# EasyEDA Pro project ProProject_TC264裸片板_2024-07-09.epro, board PCB1
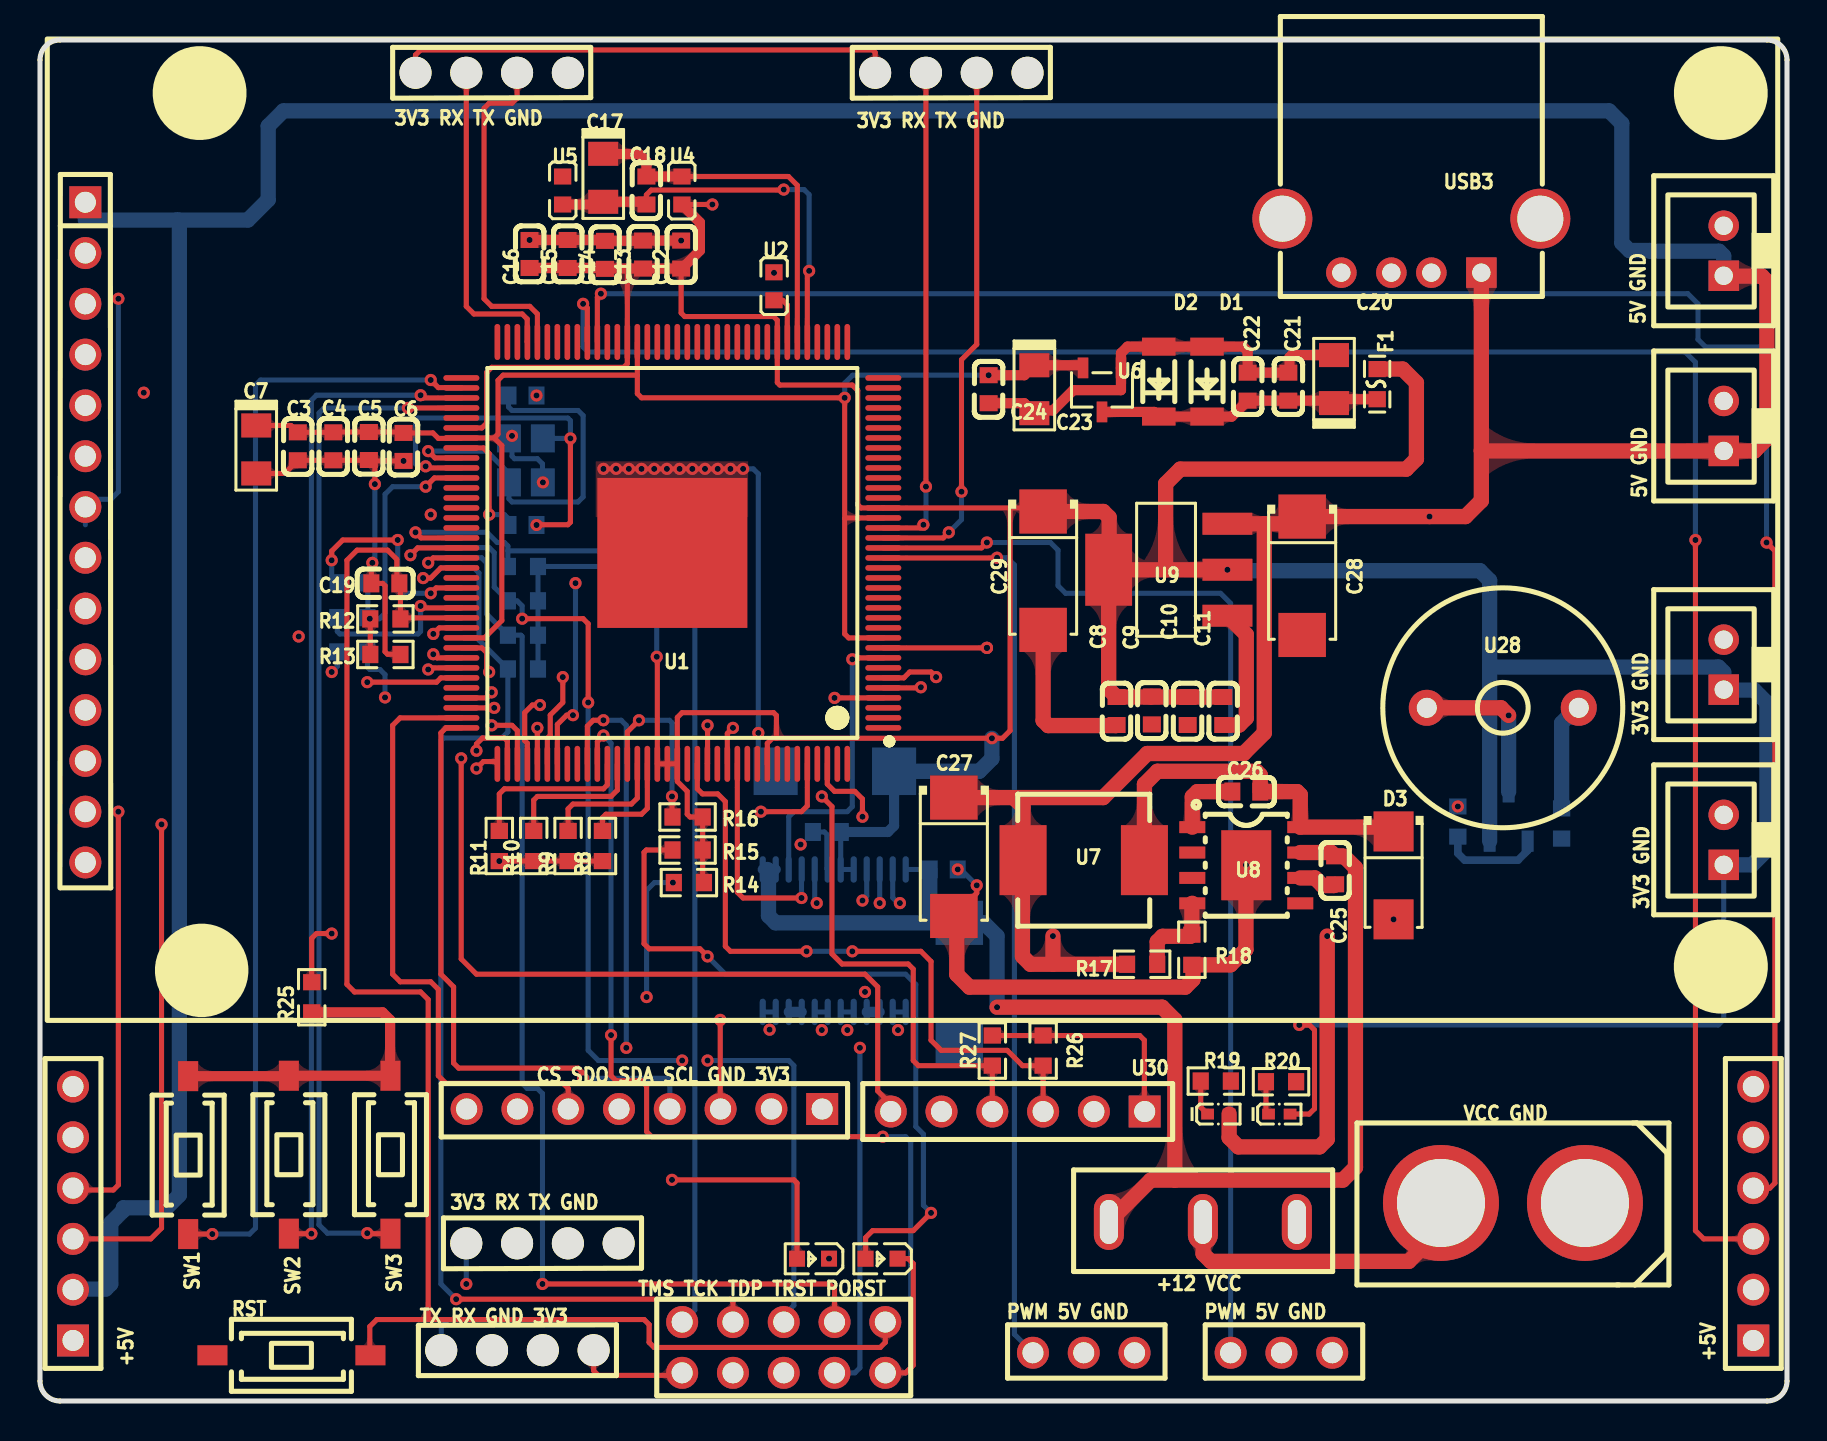
[diagram p1: board, top side]
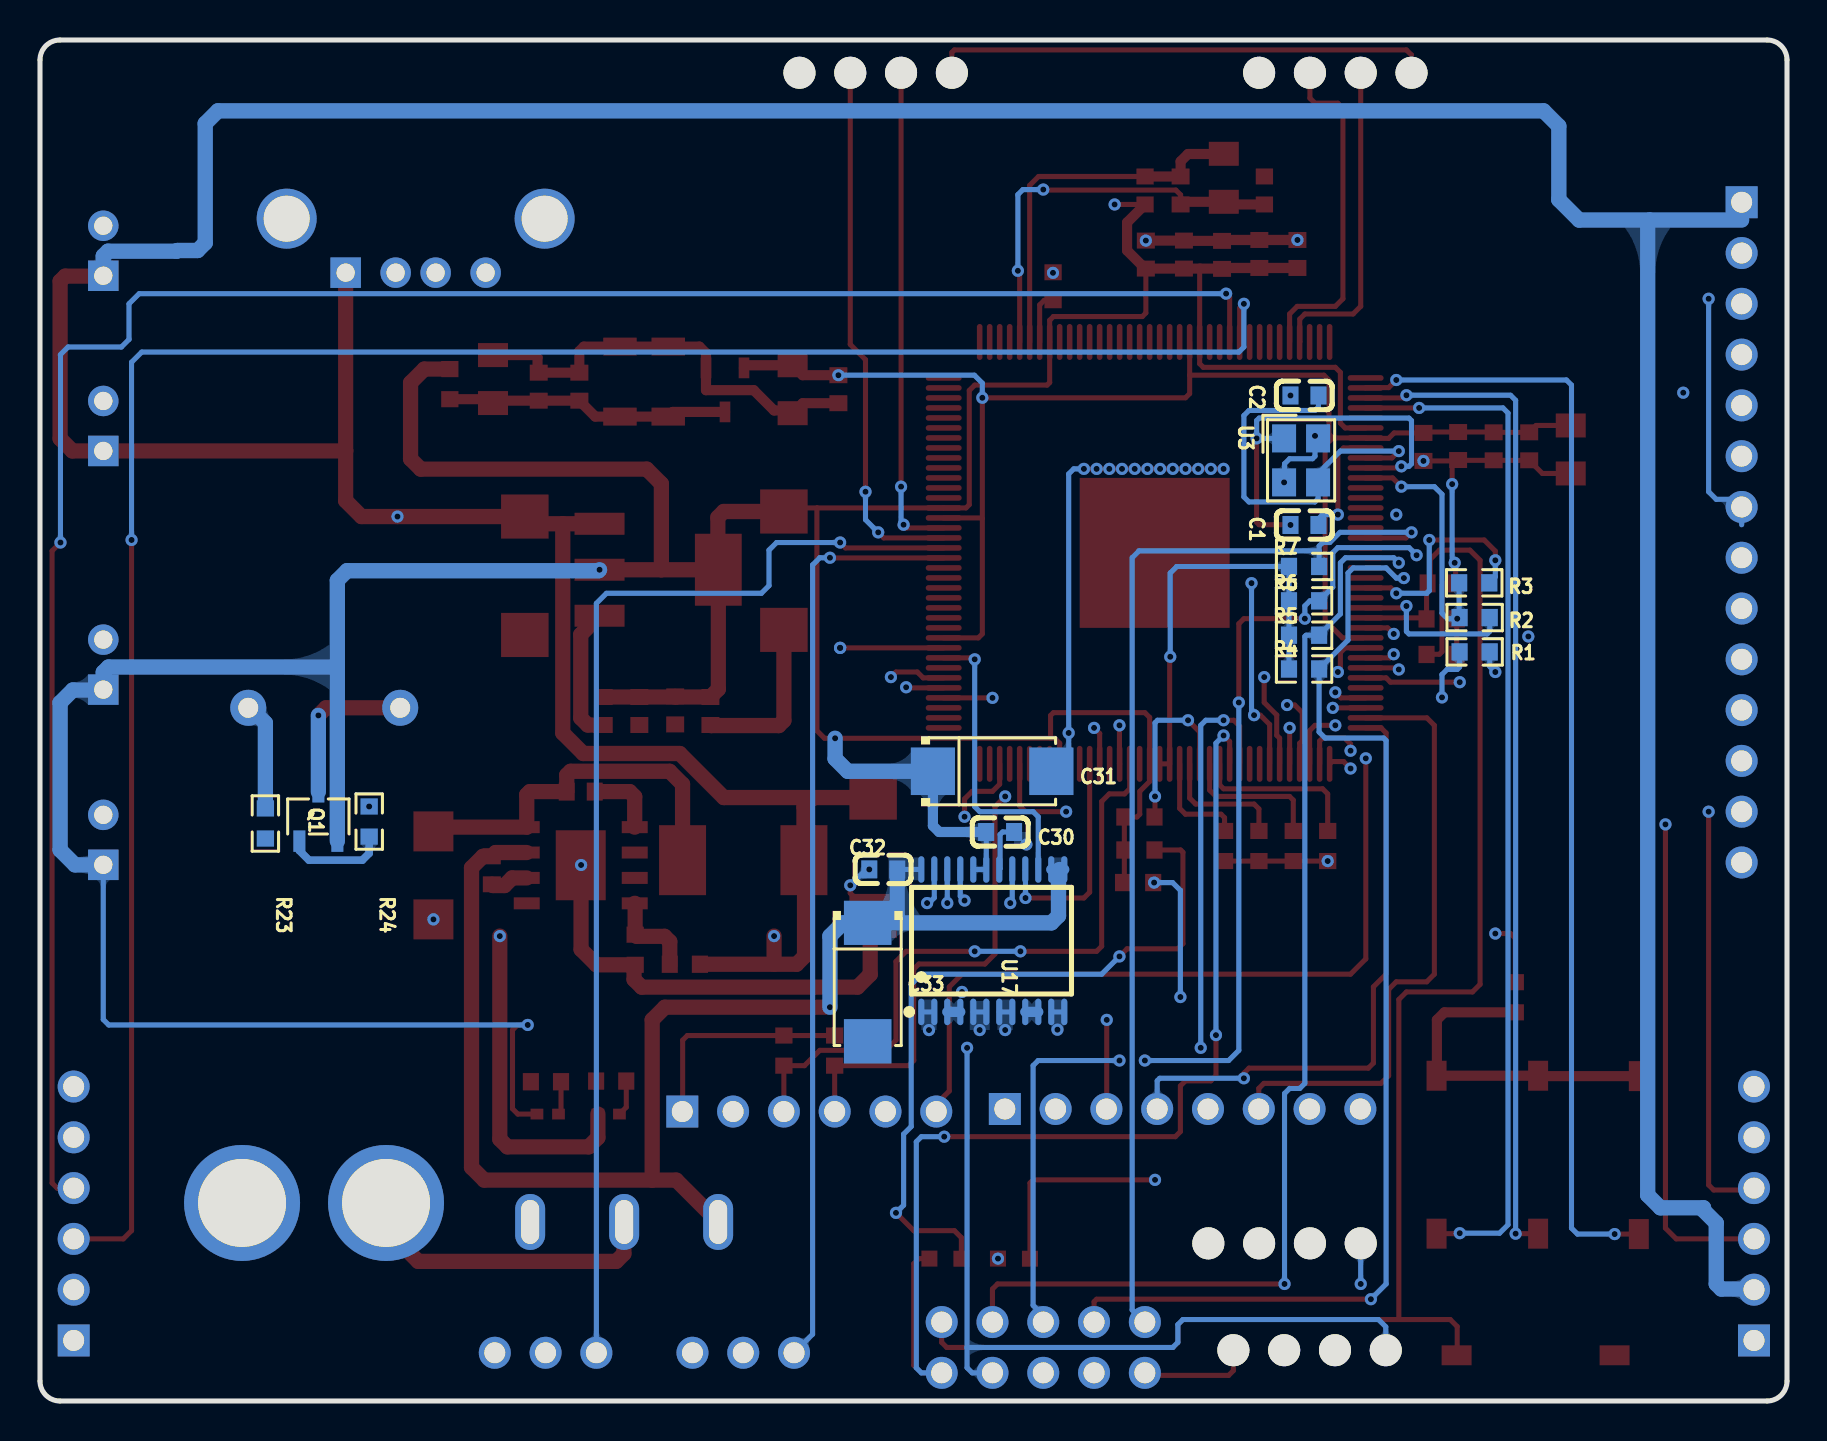
[diagram p2: board, bottom side, seen from below]

Outline 87.37 x 68.07 mm; copper layers: Top Layer, Inner1, Inner2, Bottom Layer. Coordinates in mm from the lower left corner of the outline.
Outline path: 0,67.07 0,1 arc(0.29,0.29) 1,0 86.37,0 arc(87.07,0.29) 87.37,1 87.37,67.07 arc(87.07,67.78) 86.37,68.07 1,68.07 arc(0.29,67.78) 0,67.07
Stack: Top Layer 0.035mm 外层铜厚1oz / Dielectric1 0.2104mm 7628 RC49% 8.6mil / Inner1 0.0152mm 内层铜厚 / Dielectric2 1.065mm 1.1mm H/HOZ 含铜 / Inner2 0.0152mm 内层铜厚 / Dielectric3 0.2104mm 7628 RC49% 8.6mil / Bottom Layer 0.035mm 外层铜厚1oz

## Design rules (mm)
template: JLCPCB Capability(Two Layers Board)
spacing copperThickness1oz (default): track to track 0.102, other pairs 0.152 to 0.3
spacing copperThickness2oz: track to track 0.203, other pairs 0.152 to 0.3
track width copperThickness1oz (default): min 0.127, default 0.254, max 2.54
track width copperThickness2oz: min 0.203, default 0.254, max 2.54
differential pair differentialPair (default): width min 0.127, default 0.254, max 2.54; gap min 0.152, default 0.152
via viaSize (default): diameter min 0.5, default 0.61, max 10; hole min 0.3, default 0.305, max 6.3

## Placement (name value [footprint] x y rotation side)
3V3 GND  -  [CONN-TH_2P-P2.50_BX-XH2.54-2PZZ]  84.2 36.83 90 top
3V3 GND#2  -  [CONN-TH_2P-P2.50_BX-XH2.54-2PZZ]  84.2 28.07 90 top
3V3 RX TX GND  -  [XH2.54-4p]  24.49 7.25 0 top
3V3 RX TX GND#2  -  [XH2.54-4p]  21.95 65.8 0 top
3V3 RX TX GND#3  -  [XH2.54-4p]  44.94 65.8 0 top
5V GND  -  [CONN-TH_2P-P2.50_BX-XH2.54-2PZZ]  84.2 57.53 90 top
5V GND#2  -  [CONN-TH_2P-P2.50_BX-XH2.54-2PZZ]  84.2 48.77 90 top
+5V  -  [XH2.54_6p]  85.94 10.14 90 top
+5V#2  -  [XH2.54_6p]  1.91 10.14 90 top
+12 VCC  -  [钮子开关]  58.17 8.51 270 top
C1  22pF  [C0603]  24.13 43.82 180 bottom
C2  22pF  [C0603]  24.13 50.29 180 bottom
C3  104  [C0603]  12.89 47.75 90 top
C4  104  [C0603]  14.67 47.75 90 top
C5  104  [C0603]  16.45 47.76 90 top
C6  104  [C0603]  18.18 47.72 90 top
C7  106  [CAP-SMD_L3.2-W1.6-FD]  10.81 47.59 270 top
C8  104  [C0603]  53.84 34.51 90 top
C9  104  [C0603]  55.6 34.54 90 top
C10  104  [C0603]  57.39 34.51 90 top
C11  104  [C0603]  59.17 34.51 90 top
C12  104  [C0603]  32.06 57.34 270 top
C13  104  [C0603]  30.16 57.34 270 top
C14  104  [C0603]  28.25 57.32 270 top
C15  104  [C0603]  26.39 57.37 270 top
C16  104  [C0603]  24.48 57.37 270 top
C17  106  [CAP-SMD_L3.2-W1.6-FD]  28.17 61.18 270 top
C18  104  [C0603]  30.33 60.54 90 top
C19  104  [C0603]  17.27 40.89 0 top
C20  107  [CAP-SMD_L3.2-W1.6-FD]  64.71 51.11 90 top
C21  104  [C0603]  62.43 50.73 270 top
C22  104  [C0603]  60.39 50.73 270 top
C23  106  [CAP-SMD_L3.2-W1.6-FD]  49.73 50.61 270 top
C24  104  [C0603]  47.44 50.61 90 top
C25  10uF  [C0603]  64.77 26.54 90 top
C26  0.01uF  [C0603]  60.33 30.48 180 top
C27  220uF  [CAP-SMD_L6.0-W3.2-R-RD]  45.7 27.22 90 top
C28  10uF  [CAP-SMD_L6.0-W3.2-R-RD]  63.12 41.28 90 top
C29  10uF  [CAP-SMD_L6.0-W3.2-R-RD]  50.16 41.53 90 top
C30  0.01uF  [C0603]  39.35 28.46 0 bottom
C31  10uF  [CAP-SMD_L6.0-W3.2-R-RD]  39.75 31.5 0 bottom
C32  0.01uF  [C0603]  45.19 26.59 180 bottom
C33  10uF  [CAP-SMD_L6.0-W3.2-R-RD]  45.97 20.96 90 bottom
CS SDO SDA SCL GND 3V3  -  [MPU6050-8p]  36.45 14.61 180 top
D1  ZMM3V3  [LL-34_L3.5-W1.5-LS3.5-FD]  58.36 50.99 270 top
D2  ZMM3V3  [LL-34_L3.5-W1.5-LS3.5-FD]  55.95 50.99 270 top
D3  B340A  [SMA_L4.3-W2.6-LS5.1-RD]  67.69 26.29 270 top
F1  SMD0603-005-24V  [F0603]  66.87 50.86 270 top
LED2  -  [LED_0603]  38.61 7.11 180 top
LED3  -  [LED_0603]  42.04 7.11 180 top
LED4  -  [LED_0402]  61.98 14.35 0 top
LED5  -  [LED_0402]  58.93 14.35 0 top
PWM 5V GND  -  [X2.54_3p]  50.93 2.41 0 top
PWM 5V GND#2  -  [X2.54_3p]  60.81 2.41 0 top
Q1  S8550  [SOT-23-3_L2.9-W1.6-P1.90-LS2.8-BR]  73.44 29.24 270 bottom
R1  10kΩ  [R0603]  15.62 37.47 0 bottom
R2  10kΩ  [R0603]  15.62 39.18 0 bottom
R3  10kΩ  [R0603]  15.64 40.92 0 bottom
R4  10kΩ  [R0603]  24.15 36.61 0 bottom
R5  10kΩ  [R0603]  24.15 38.3 0 bottom
R6  10kΩ  [R0603]  24.15 40.02 0 bottom
R7  10kΩ  [R0603]  24.15 41.74 0 bottom
R8  10kΩ  [R0603]  28.13 27.76 270 top
R9  10kΩ  [R0603]  26.41 27.76 270 top
R10  10kΩ  [R0603]  24.69 27.76 270 top
R11  10kΩ  [R0603]  22.97 27.76 270 top
R12  10kΩ  [R0603]  17.27 39.12 180 top
R13  1kΩ  [R0603]  17.27 37.34 180 top
R14  10kΩ  [R0603]  32.45 25.93 0 top
R15  10kΩ  [R0603]  32.38 27.56 0 top
R16  10kΩ  [R0603]  32.38 29.21 0 top
R17  10kΩ  [R0603]  55.12 21.84 180 top
R18  3.24kΩ  [R0603]  57.6 22.57 90 top
R19  10kΩ  [R0603]  58.8 16 0 top
R20  4.7kΩ  [R0603]  62.06 15.97 0 top
R23  100Ω  [R0603]  76.09 28.89 270 bottom
R24  100Ω  [R0603]  70.91 28.98 90 bottom
R25  4.7K  [R0603]  13.59 20.19 90 top
R26  2.2kΩ  [R0603]  50.16 17.53 90 top
R27  2.2kΩ  [R0603]  47.62 17.53 90 top
RST  轻触按键3*6*2.5  [SW-SMD_L6.0-W3.6-LS8.0]  12.57 2.29 0 top
SW1  轻触按键3*6*2.5  [SW-SMD_L6.0-W3.6-LS8.0]  7.41 12.3 90 top
SW2  轻触按键3*6*2.5  [SW-SMD_L6.0-W3.6-LS8.0]  12.45 12.32 90 top
SW3  轻触按键3*6*2.5  [SW-SMD_L6.0-W3.6-LS8.0]  17.53 12.32 90 top
TMS TCK TDP TRST PORST  -  [TC264]  37.19 2.55 0 top
TX RX GND 3V3  -  [XH2.54-4p]  24.51 3.18 180 top
U1  TC264D40F200WBCKXUMA1  [LQFP-144_L20.0-W20.0-P0.50-LS22.0-BL-EP]  31.62 42.42 90 top
U2  600Ω±25%100MHz  [L0603]  36.7 55.75 270 top
U3  3225-20MHZ-15PF-10PPM  [CRYSTAL-SMD_4P-L3.2-W2.5-BL]  24.3 47.05 270 bottom
U4  600Ω±25%100MHz  [L0603]  32.1 60.54 90 top
U5  600Ω±25%100MHz  [L0603]  26.13 60.54 270 top
U6  ME6216A13M3G  [SOT-23-3_L3.0-W1.7-P0.95-LS2.9-BR]  53.11 50.57 90 top
U7  15uH  [IND-SMD_L6.6-W6.6]  52.2 27.05 0 top
U8  TPS5430DDAR  [ESOP-8_L4.9-W3.9-P1.27-LS6.0-TL-EP]  60.33 26.8 0 top
U9  AMS1117-3.3  [SOT-223-3_L6.5-W3.4-P2.30-LS7.0-BR]  56.41 41.58 0 top
U17  TB6612FNG,C,8,EL  [SSOP-24_L8.3-W5.6-P0.65-LS7.6-BL]  39.72 23.02 180 bottom
U28  2.6kHz  [BUZ-TH_BD12.0-P7.60-D0.6-FD]  73.15 34.67 0 top
U30  -  [XH2.54_6p]  48.13 14.73 180 top
U32  WJ124-3.81-14P  [电容触摸]  56.37 50.94 270 top
USB3  HXAF90WJDGZB  [USB-A-TH_HXAF90WJDGZB]  68.58 57.79 180 top
VCC GND  XT60  [CONN-TH_XT60]  73.66 9.91 180 top

## Footprints (pads in the part's own frame, mm; a bottom-side part is the same pattern mirrored in y, then rotated)
BUZ-TH_BD12.0-P7.60-D0.6-FD
  round 1.8 hole 1: 1(-3.8,0) 2(3.8,0)
C0603
  rect 0.8x0.9 smd: 1(-0.7,0) 2(0.7,0)
CAP-SMD_L3.2-W1.6-FD
  rect 1.2x1.5 smd: 1(-1.2,0) 2(1.2,0)
CAP-SMD_L6.0-W3.2-R-RD
  rect 2.208x2.376 smd: 1(2.961,0) 2(-2.961,0)
CONN-TH_2P-P2.50_BX-XH2.54-2PZZ
  rect 1.524x1.524 hole 0.914: 1(-1.25,0)
  round 1.524 hole 0.914: 2(1.25,0)
CONN-TH_XT60
  round 5.8 hole 4.4: 1(-3.6,0) 2(3.6,0)
CRYSTAL-SMD_4P-L3.2-W2.5-BL
  rect 1.4x1.2 smd: 1(-1.1,-0.85) 2(1.1,-0.85) 3(1.1,0.85) 4(-1.1,0.85)
ESOP-8_L4.9-W3.9-P1.27-LS6.0-TL-EP
  rect 1.3x0.6 smd: 1(-2.7,1.905) 2(-2.7,0.635) 3(-2.7,-0.635) 4(-2.7,-1.905) 5(2.7,-1.905) 6(2.7,-0.635) 7(2.7,0.635) 8(2.7,1.905)
  rect 2.5x3.5 smd: 9(0,0)
F0603
  rect 0.806x0.864 smd: 1(-0.753,0) 2(0.753,0)
IND-SMD_L6.6-W6.6
  rect 2.35x3.5 smd: 1(-3.035,0) 2(3.035,0)
L0603
  rect 0.8x0.864 smd: 1(-0.7,0) 2(0.7,0)
LED_0402
  rect 0.637x0.541 smd: 1(-0.538,0) 2(0.538,0)
LED_0603
  rect 0.8x0.8 smd: 1(-0.851,-0.01) 2(0.75,-0.005)
LL-34_L3.5-W1.5-LS3.5-FD
  rect 0.9x1.677 smd: 1(-1.75,0)
  rect 0.9x1.676 smd: 2(1.75,0)
LQFP-144_L20.0-W20.0-P0.50-LS22.0-BL-EP
  oval 0.28x1.8 smd: 1(-8.75,-10.55) 2(-8.25,-10.55) 3(-7.75,-10.55) 4(-7.25,-10.55) 5(-6.75,-10.55) 6(-6.25,-10.55) 7(-5.75,-10.55) 8(-5.25,-10.55) 9(-4.75,-10.55) 10(-4.25,-10.55) 11(-3.75,-10.55) 12(-3.25,-10.55) 13(-2.75,-10.55) 14(-2.25,-10.55) 15(-1.75,-10.55) 16(-1.25,-10.55) 17(-0.75,-10.55) 18(-0.25,-10.55) 19(0.25,-10.55) 20(0.75,-10.55) 21(1.25,-10.55) 22(1.75,-10.55) 23(2.25,-10.55) 24(2.75,-10.55) 25(3.25,-10.55) 26(3.75,-10.55) 27(4.25,-10.55) 28(4.75,-10.55) 29(5.25,-10.55) 30(5.75,-10.55) 31(6.25,-10.55) 32(6.75,-10.55) 33(7.25,-10.55) 34(7.75,-10.55) 35(8.25,-10.55) 36(8.75,-10.55) 73(8.75,10.55) 74(8.25,10.55) 75(7.75,10.55) 76(7.25,10.55) 77(6.75,10.55) 78(6.25,10.55) 79(5.75,10.55) 80(5.25,10.55) 81(4.75,10.55) 82(4.25,10.55) 83(3.75,10.55) 84(3.25,10.55) 85(2.75,10.55) 86(2.25,10.55) 87(1.75,10.55) 88(1.25,10.55) 89(0.75,10.55) 90(0.25,10.55) 91(-0.25,10.55) 92(-0.75,10.55) 93(-1.25,10.55) 94(-1.75,10.55) 95(-2.25,10.55) 96(-2.75,10.55) 97(-3.25,10.55) 98(-3.75,10.55) 99(-4.25,10.55) 100(-4.75,10.55) 101(-5.25,10.55) 102(-5.75,10.55) 103(-6.25,10.55) 104(-6.75,10.55) 105(-7.25,10.55) 106(-7.75,10.55) 107(-8.25,10.55) 108(-8.75,10.55)
  oval 1.8x0.28 smd: 37(10.55,-8.75) 38(10.55,-8.25) 39(10.55,-7.75) 40(10.55,-7.25) 41(10.55,-6.75) 42(10.55,-6.25) 43(10.55,-5.75) 44(10.55,-5.25) 45(10.55,-4.75) 46(10.55,-4.25) 47(10.55,-3.75) 48(10.55,-3.25) 49(10.55,-2.75) 50(10.55,-2.25) 51(10.55,-1.75) 52(10.55,-1.25) 53(10.55,-0.75) 54(10.55,-0.25) 55(10.55,0.25) 56(10.55,0.75) 57(10.55,1.25) 58(10.55,1.75) 59(10.55,2.25) 60(10.55,2.75) 61(10.55,3.25) 62(10.55,3.75) 63(10.55,4.25) 64(10.55,4.75) 65(10.55,5.25) 66(10.55,5.75) 67(10.55,6.25) 68(10.55,6.75) 69(10.55,7.25) 70(10.55,7.75) 71(10.55,8.25) 72(10.55,8.75) 109(-10.55,8.75) 110(-10.55,8.25) 111(-10.55,7.75) 112(-10.55,7.25) 113(-10.55,6.75) 114(-10.55,6.25) 115(-10.55,5.75) 116(-10.55,5.25) 117(-10.55,4.75) 118(-10.55,4.25) 119(-10.55,3.75) 120(-10.55,3.25) 121(-10.55,2.75) 122(-10.55,2.25) 123(-10.55,1.75) 124(-10.55,1.25) 125(-10.55,0.75) 126(-10.55,0.25) 127(-10.55,-0.25) 128(-10.55,-0.75) 129(-10.55,-1.25) 130(-10.55,-1.75) 131(-10.55,-2.25) 132(-10.55,-2.75) 133(-10.55,-3.25) 134(-10.55,-3.75) 135(-10.55,-4.25) 136(-10.55,-4.75) 137(-10.55,-5.25) 138(-10.55,-5.75) 139(-10.55,-6.25) 140(-10.55,-6.75) 141(-10.55,-7.25) 142(-10.55,-7.75) 143(-10.55,-8.25) 144(-10.55,-8.75)
  rect 7.5x7.5 smd: 145(0,0)
MPU6050-8p
  rect 1.6x1.6 hole 1.05: 1(-2.667,0)
  round 1.6 hole 1.05: 2(-0.127,0) 3(2.413,0) 4(4.953,0) 5(7.493,0) 6(10.033,0) 7(12.573,0) 8(15.113,0)
R0603
  rect 0.806x0.864 smd: 1(-0.753,0) 2(0.753,0)
SMA_L4.3-W2.6-LS5.1-RD
  rect 2x2 smd: 1(-2.2,0) 2(2.2,0)
SOT-23-3_L2.9-W1.6-P1.90-LS2.8-BR
  rect 1.07x0.6 smd: 1(1.235,-0.95) 2(1.235,0.95) 3(-1.235,0)
SOT-23-3_L3.0-W1.7-P0.95-LS2.9-BR
  rect 1.038x0.532 smd: 1(1.101,-0.95) 2(1.101,0.95) 3(-1.101,0)
SOT-223-3_L6.5-W3.4-P2.30-LS7.0-BR
  rect 2.5x1.1 smd: 1(2.97,-2.3) 2(2.97,0) 3(2.97,2.3)
  rect 2.34x3.6 smd: 4(-2.97,0)
SSOP-24_L8.3-W5.6-P0.65-LS7.6-BL
  oval 0.308x1.324 smd: 1(-3.575,-3.562) 2(-2.925,-3.562) 3(-2.275,-3.562) 4(-1.625,-3.562) 5(-0.975,-3.562) 6(-0.325,-3.562) 7(0.325,-3.562) 8(0.975,-3.562) 9(1.625,-3.562) 10(2.275,-3.562) 11(2.925,-3.562) 12(3.575,-3.562) 13(3.575,3.562) 14(2.925,3.562) 15(2.275,3.562) 16(1.625,3.562) 17(0.975,3.562) 18(0.325,3.562) 19(-0.325,3.562) 20(-0.975,3.562) 21(-1.625,3.562) 22(-2.275,3.562) 23(-2.925,3.562) 24(-3.575,3.562)
SW-SMD_L6.0-W3.6-LS8.0
  rect 1.5x1 smd: 1(-3.95,0) 2(3.95,0)
TC264
  round 1.6 hole 1.05: 1(-5.08,-1.143) 2(-2.54,-1.143) 3(0,-1.143) 4(2.54,-1.143) 5(5.08,-1.143) 6(5.08,1.397) 7(2.54,1.397) 8(0,1.397) 9(-2.54,1.397) 10(-5.08,1.397)
USB-A-TH_HXAF90WJDGZB
  rect 1.524x1.524 hole 0.914: 1(-3.5,1.35)
  round 1.524 hole 0.914: 2(-1,1.35) 3(1,1.35) 4(3.5,1.35)
  round 3 hole 2.3: 5(6.45,-1.35) 6(-6.45,-1.35)
X2.54_3p
  round 1.6 hole 1.05: 1(-1.27,0) 2(1.27,0) 3(3.81,0)
XH2.54-4p
  round 1.6 hole 4.05x1.05: 1(-3.175,0.635) 2(-0.635,0.635) 3(1.905,0.635) 4(4.445,0.635)
XH2.54_6p
  rect 1.6x1.6 hole 1.05: 1(-7.112,0.254)
  round 1.6 hole 1.05: 2(-4.572,0.254) 3(-2.032,0.254) 4(0.508,0.254) 5(3.048,0.254) 6(5.588,0.254)
电容触摸
  rect 1.6x1.6 hole 1.05: 1(-9.017,-54.102)
  round 1.6 hole 1.05: 2(-6.477,-54.102) 3(-3.937,-54.102) 4(-1.397,-54.102) 5(1.143,-54.102) 6(3.683,-54.102) 7(6.223,-54.102) 8(8.763,-54.102) 9(11.303,-54.102) 10(13.843,-54.102) 11(16.383,-54.102) 12(18.923,-54.102) 13(21.463,-54.102) 14(24.003,-54.102)
钮子开关
  oval 2.8x1.5 hole 2.2x0.9: 1(-0.447,-4.713) 2(-0.447,-0.013) 3(-0.447,4.688)

## Nets
1.3V: C3.2 C4.2 C5.2 C6.2 C7.1 C23.1 C24.2 U1.10 U1.22 U1.58 U1.79 U1.99 U6.2
3V3: 3V3 GND.1 3V3 GND#2.1 3V3 RX TX GND.1 3V3 RX TX GND#2.1 3V3 RX TX GND#3.1 C8.2 C9.2 C10.2 C11.2 C12.2 C13.2 C14.2 C15.2 C16.2 C29.1 C30.2 C31.1 CS SDO SDA SCL GND 3V3.1 F1.1 LED4.2 Q1.2 R1.2 R2.2 R3.2 R4.2 R5.2 R6.2 R7.2 R12.2 R13.2 R14.2 R15.2 R16.2 R26.2 R27.2 TMS TCK TDP TRST PORST.1 TX RX GND 3V3.1 U1.23 U1.44 U1.59 U1.78 U1.83 U1.125 U1.126 U1.127 U1.136 U4.1 U9.2 U9.4 U17.19 U17.20 U30.1
+5V: 5V GND.1 5V GND#2.1 +5V.2 +5V#2.2 C27.1 C28.1 LED5.2 PWM 5V GND.2 PWM 5V GND#2.2 R17.2 U7.1 U9.3 U32.1 USB3.1
+12V: +12 VCC.1 C25.2 C32.2 C33.1 U8.7 U17.13 U17.14 U17.24
GND: 3V3 GND.2 3V3 GND#2.2 3V3 RX TX GND.4 3V3 RX TX GND#2.4 3V3 RX TX GND#3.4 5V GND.2 5V GND#2.2 +5V.5 +5V#2.5 C1.2 C2.1 C3.1 C4.1 C5.1 C6.1 C7.2 C8.1 C9.1 C10.1 C11.1 C12.1 C13.1 C14.1 C15.1 C16.1 C19.1 C25.1 C27.2 C28.2 C29.2 C30.1 C31.2 C32.1 C33.2 CS SDO SDA SCL GND 3V3.2 D3.2 PWM 5V GND.3 PWM 5V GND#2.3 R8.2 R9.2 R10.2 R11.2 R13.1 R18.1 R19.2 R20.2 R23.2 R25.2 RST.1 TMS TCK TDP TRST PORST.2 TMS TCK TDP TRST PORST.3 TX RX GND 3V3.2 U1.80 U1.145 U2.1 U3.2 U3.4 U5.1 U8.6 U8.9 U9.1 U17.3 U17.4 U17.9 U17.10 U17.18 U30.2 U32.2 USB3.4 USB3.5 USB3.6 VCC GND.1
VCC: +12 VCC.2 VCC GND.2
VDDA: C17.1 C18.2 U1.42 U4.2
VSSA: C17.2 C18.1 U1.41 U5.2
AIN1: U1.4 U17.21
AIN2: U1.5 U17.22
AN0: U1.57
AN1: U1.56
AN2: U1.55
AN3: U1.54
AN4: U1.53
AN5: U1.52
AN6: U1.51
AN7: U1.50
AN8: U1.49
AN10: U1.48
AN11: U1.47
AN12: U1.46
AN13: U1.45
AN16: U1.40
AN17: U1.39
AN20: U1.38
AN21: U1.37
AN24: U1.36
AN25: U1.35
AN35: U1.34
AN36: U1.33
AN37: U1.32
AN38: U1.31
AN39: U1.30
AN44: U1.29
AN45: U1.28
AN46: U1.27
AN47: U1.26
AN48: U1.25
AN49: U1.24
AO1: +5V.1 U17.1 U17.2
AO2: +5V.6 U17.5 U17.6
BIN1: U1.132 U17.17
BIN2: U1.133 U17.16
BO1: +5V#2.1 U17.11 U17.12
BO2: +5V#2.6 U17.7 U17.8
BUZZER: R24.2 U1.9
CCD_CLK: U1.13
CCD_SI: U1.14
D+: USB3.3
D-: USB3.2
ESR0: R1.1 U1.98
ESR1: R2.1 U1.96
IMU_CS: CS SDO SDA SCL GND 3V3.6 U1.107
IMU_SCL: CS SDO SDA SCL GND 3V3.3 U1.105
IMU_SDA: CS SDO SDA SCL GND 3V3.4 U1.108
IMU_SDO: CS SDO SDA SCL GND 3V3.5 U1.106
KEY1: SW1.1 U1.74
KEY2: SW2.1 U1.75
KEY3: SW3.1 U1.76
L_ENCA: +5V.3 U1.63
L_ENCB: +5V.4 U1.62
LCD_BLK: U1.115 U32.8
LCD_CS: U1.111 U32.3
LCD_DC: U1.109 U32.5
LCD_MOSI: U1.114 U32.6
LCD_RST: U1.110 U32.4
LCD_SCK: U1.112 U32.7
P0.0: U1.11
P0.1: U1.12
P0.4: U1.15
P0.5: U1.16
P0.6: U1.17
P0.7: PWM 5V GND.1 U1.18
P0.8: PWM 5V GND#2.1 U1.19
P0.9: 3V3 RX TX GND#3.3 U1.20
P0.12: 3V3 RX TX GND#3.2 U1.21
P2.0: U1.1
P2.1: U1.2
P2.2: U1.3
P2.5: U1.6 U17.23
P2.6: U1.7
P2.7: U1.8 U17.15
P10.1: +5V#2.4 U1.140
P10.2: U1.141
P10.3: +5V#2.3 U1.142
P10.5: U1.143
P10.6: U1.144
P11.6: U1.134
P11.9: U1.135
P11.10: U1.137
P11.11: U1.138
P11.12: U1.139
P13.0: U1.128
P13.1: R26.1 U1.129 U30.3
P13.2: R27.1 U1.130 U30.4
P13.3: U1.131
P14.0: 3V3 RX TX GND.3 LED2.1 TMS TCK TDP TRST PORST.4 TX RX GND 3V3.4 U1.118
P14.1: 3V3 RX TX GND.2 LED3.1 TMS TCK TDP TRST PORST.5 TX RX GND 3V3.3 U1.119
P14.2: R11.1 U1.120
P14.3: R10.1 U1.121
P14.4: R16.1 U1.122
P14.5: R9.1 U1.123
P14.6: R8.1 U1.124
P15.4: U1.113 U30.5
P15.7: U1.116
P15.8: U1.117
P20.0: U1.93
P20.2: R3.1 U1.94
P20.3: U1.95
P20.6: U1.100 U32.10
P20.7: U1.101 U32.11
P20.8: U1.102 U30.6 U32.12
P20.9: U1.103 U32.13
P20.10: U1.104
P21.2: U1.84
P21.3: U1.85
P21.4: U1.86
P21.5: U1.87
P21.6: U1.88
P22.3: U1.77
P23.1: U1.73
P32.0: U1.70
P32.4: U1.72
P33.4: U1.60
P33.5: U1.61
P33.8: U1.64
P33.9: U1.65
P33.10: U1.66
P33.11: U1.67
P33.12: 3V3 RX TX GND#2.3 U1.68
P33.13: 3V3 RX TX GND#2.2 U1.69
PORST: C19.2 R12.1 RST.2 TMS TCK TDP TRST PORST.6 U1.97
TCK: R4.1 TMS TCK TDP TRST PORST.9 U1.92
TDO: R6.1 TMS TCK TDP TRST PORST.8 U1.90
TMS: R7.1 TMS TCK TDP TRST PORST.10 U1.89
TRST: R5.1 TMS TCK TDP TRST PORST.7 U1.91
VGATE1P: U1.71
$1N4159: U1.43 U2.2
$1N5074: C1.1 U1.82 U3.1
$1N5220: C2.2 U1.81 U3.3
$1N7124: LED2.2 R14.1
$1N7149: LED3.2 R15.1
$1N7661: C20.1 C21.2 C22.2 D1.2 D2.2 F1.2 U6.3
$1N7734: C20.2 C21.1 C22.1 C23.2 C24.1 D1.1 D2.1 U6.1
$1N8172: C26.2 U8.1
$1N8173: C26.1 D3.1 U7.2 U8.8
$1N8175: R17.1 R18.2 U8.4
$1N8904: LED4.1 R20.1
$1N8906: LED5.1 R19.1
$1N14813: Q1.3 U28.1
$1N14815: Q1.1 R24.1
$1N14820: R23.1 U28.2
$1N14998: R25.1 SW1.2 SW2.2 SW3.2

Pads without a net: +12 VCC 3; CS SDO SDA SCL GND 3V3 7 8; U8 2 3 5; U32 9 14

## Via types
v1: diameter 0.61, hole 0.305, Top Layer to Bottom Layer, 145 vias

## Routing (per net, layer and track width the routed paths; a pad name or vN(x,y) marks a point on that pad's centre or on a via; arc(x,y) is an arc through that point)
1.3V: length 75.5
  Top Layer w0.254: 21.2,38.17 22.23,38.17 23.1,39.04 23.1,47.79 22.72,48.17 ; 29.87,51.31 29.87,50.39 30.08,50.18 v1(40.24,50.18) 40.24,44.14 ; 29.87,51.31 23.16,51.31 22.91,51.05 22.91,48.36 22.72,48.17 ; 29.87,51.31 U1.58 ; 40.24,44.14 40.24,38.37 40.44,38.17 U1.10 ; 40.24,44.14 40.27,44.17 U1.22 ; 22.72,48.17 21.2,48.17 ; C7.1 12.55,48.79 C3.2 C4.2 14.68,48.46 C5.2 18.14,48.46 C6.2 19.65,48.42 19.92,48.15 21.05,48.15 U1.79
  Top Layer w0.508: U6.2 52.03,51.81 C23.1 49.23,51.31 v1(47.44,51.31)
  Bottom Layer w0.254: v1(47.44,51.31) 40.64,51.31 40.24,50.91 v1(40.24,50.18)
3V3: length 440.9
  Top Layer w0.254: v1(30.84,37.22) 30.87,37.19 U1.125 U1.126 U1.127 ; 29.36,56.64 29.37,56.62 U1.59 29.37,51.88 29.19,51.7 22.59,51.7 22.33,51.45 22.33,48.91 22.1,48.67 U1.78 ; U1.127 31.87,30.99 32.37,30.49 32.37,29.35 32.51,29.21 R16.2 R15.2 33.14,26 R14.2 ; U1.127 31.87,34.19 32.11,34.43 36.69,34.43 36.83,34.29 36.83,33.15 ; 36.83,33.15 v1(47.6,33.15) 48.13,33.15 48.51,33.53 48.51,44.66 48.5,44.67 ; 36.83,33.15 36.62,33.15 36.37,32.9 U1.136 ; v1(16.49,39.13) 16.52,39.1 ; 16.52,39.1 R12.2 ; 16.52,39.1 R13.2 ; R27.2 R26.2 54.99,18.28 55.23,18.05 55.23,14.5 U30.1 ; 48.5,44.67 49.99,44.67 C29.1 ; 48.5,44.67 U1.23 41.06,44.67 40.89,44.83 40.89,50.54 40.62,50.81 37,50.81 36.87,50.94 U1.44 36.87,54.05 36.69,54.24 32.24,54.24 32.06,54.42 C12.2 ; LED4.2 63.47,14.35 63.74,14.62 63.74,18.55 63.48,18.81 v1(62.97,18.81) ; U1.83 19.72,46.17 v1(19.29,45.73) ; 3V3 RX TX GND#3.1 41.77,67.45 41.64,67.58 19.03,67.58 18.78,67.32 3V3 RX TX GND#2.1 ; TMS TCK TDP TRST PORST.1 31.99,1.28 27.92,1.28 27.69,1.52 TX RX GND 3V3.1 ; U4.1 v1(33.63,59.84)
  Top Layer w0.508: U4.1 33,58.95 33,57.54 32.1,56.64 C12.2 C13.2 28.27,56.64 C14.2 28.21,56.67 C15.2 C16.2
  Top Layer w0.762: U9.4 53.47,41.6 53.47,44.2 53.17,44.49 C29.1 ; U9.4 53.44,35.61 C8.2 55.57,35.21 ; U9.4 56.29,41.58 ; 55.57,35.21 C9.2 ; 55.57,35.21 C10.2 C11.2 ; 56.29,41.58 56.29,45.88 57.02,46.61 68.33,46.61 68.83,47.12 68.83,50.93 68.15,51.61 F1.1 ; 56.29,41.58 v1(59.38,41.58)
  Inner1 w0.254: v1(16.49,39.13) 16.49,39.76 16.24,40.02 13.19,40.02 12.94,39.76 v1(12.94,38.24) ; 3V3 RX TX GND#3.1 41.77,60.21 41.4,59.84 v1(33.63,59.84) ; CS SDO SDA SCL GND 3V3.1 39.12,12.7 39.35,12.46 54.85,12.46 55.23,12.84 55.23,14.46 U30.1 55.25,18.7 55.35,18.81 v1(62.97,18.81) ; 3V3 RX TX GND#2.1 18.78,64.27 19.03,64.02 19.92,64.02 20.43,63.51 20.43,46.49 20.18,46.24 19.79,46.24 v1(19.29,45.73)
  Inner2 w0.254: TX RX GND 3V3.1 27.67,2.56 27.67,4.84 27.41,5.09 21.7,5.09 21.32,5.47 v1(21.32,5.85) ; v1(12.94,38.24) 12.94,35.32 13.06,35.19 v1(17.25,35.19) ; CS SDO SDA SCL GND 3V3.1 39.1,14.59 39.1,12.59 38.84,12.33 36.56,12.33 36.3,12.08 36.3,5.47 35.92,5.09 33.38,5.09 33.26,4.97 33.26,1.54 33.13,1.41 TMS TCK TDP TRST PORST.1
  Bottom Layer w0.254: v1(17.25,35.19) 17.25,36.33 17,36.59 16.49,36.59 16.37,36.71 R1.2 ; R2.2 16.4,39.21 R3.2 ; v1(62.97,18.81) 83.93,18.81 84.2,19.08 3V3 GND#2.1 ; C30.2 40.04,28.45 U17.19 U17.20 ; v1(16.49,39.13) 16.98,39.13 17.25,39.4 17.25,45.35 17.64,45.73 v1(19.29,45.73) ; v1(30.84,37.22) 30.84,41.41 30.52,41.74 R7.2 R6.2 R5.2 R4.2 ; v1(21.32,5.85) 21.32,7.89
  Bottom Layer w0.508: C30.2 42.4,28.46 42.71,28.77 C31.1
  Bottom Layer w0.762: 3V3 GND#2.1 85.62,26.82 86.36,27.56 86.36,34.93 85.72,35.56 84.22,35.56 3V3 GND.1 84.2,36.45 83.94,36.71 72.5,36.71 ; v1(47.6,33.15) 47.6,32.13 46.97,31.5 C31.1 ; 72.5,36.71 72.5,41.04 72.01,41.53 59.43,41.53 v1(59.38,41.58) ; 72.5,36.71 Q1.2
+5V: length 363.5
  Top Layer w0.762: v1(64.37,23.25) 64.37,13.09 63.99,12.71 59.93,12.71 59.47,13.17 LED5.2 ; v1(50.66,23.25) 50.66,21.84 ; 72.08,47.53 USB3.1 ; 72.08,47.53 72.1,47.52 5V GND#2.1 85.75,47.52 86.36,48.13 86.36,56.01 86.11,56.26 84.22,56.26 5V GND.1 ; 72.08,47.53 72.08,45.03 71.29,44.24 v1(69.49,44.24) C28.1 62.76,43.88 61.22,43.88 ; C27.1 48.69,30.18 ; 48.69,30.18 49.16,29.71 U7.1 49.13,27.02 49.13,22.24 49.53,21.84 R17.2 ; 48.69,30.18 53.17,30.18 55.37,32.39 60.2,32.39 61.22,33.41 61.22,43.88 ; 61.22,43.88 U9.3
  Inner1 w0.762: 62.06,1.03 80.25,1.03 80.75,1.54 80.75,5.54 ; 62.06,1.03 52.81,1.03 52.2,1.65 PWM 5V GND.2 ; 62.06,1.03 62.08,1.05 PWM 5V GND#2.2 ; 80.75,5.54 80.78,5.57 +5V.2 ; 80.75,5.54 80.75,43.83 80.35,44.24 v1(69.49,44.24) ; v1(50.66,23.25) v1(64.37,23.25)
  Bottom Layer w0.762: 6.87,59.07 6.97,58.97 6.97,10.3 6.33,9.66 4.17,9.66 4.17,9.54 3.54,8.9 3.54,5.85 3.28,5.6 1.68,5.6 +5V#2.2 ; 6.87,59.07 2.27,59.07 ; 6.87,59.07 10.4,59.07 11.41,60.08 11.41,63.77 12.17,64.53 78.47,64.53 79.1,63.89 79.1,57.92 79.48,57.54 80.5,57.54 80.54,57.51 83.97,57.51 84.2,57.27 5V GND.1
+12V: length 72.3
  Top Layer w0.762: v1(47.86,19.7) 56.12,19.7 56.75,19.06 56.75,11.05 ; 56.75,11.05 55.55,11.05 +12 VCC.1 ; 56.75,11.05 65.15,11.05 65.79,11.68 65.79,26.67 65.21,27.24 C25.2 64.58,27.43 U8.7
  Bottom Layer w0.254: U17.24 44.49,26.59 C32.2
  Bottom Layer w0.508: U17.14 U17.13
  Bottom Layer w0.762: v1(47.86,19.7) 47.86,23.25 47.2,23.92 C33.1 ; 36.38,26.59 36.43,26.54 36.43,24.27 36.78,23.92 C33.1 ; C33.1 45.75,24.14 44.56,24.14 44.5,24.21 C32.2
GND: length 192.3
  Top Layer w0.254: 16.49,47.02 16.75,46.77 v1(16.75,45.86) ; 16.49,47.02 v1(18.18,47.02) ; 16.49,47.02 C5.1 16.43,47.05 C4.1 C3.1 12.23,46.39 C7.2 ; U1.80 22.18,47.67 22.46,47.38 v1(22.46,44.34) ; R8.2 R9.2 R10.2 v1(22.97,27.01) ; v1(28.18,46.62) v1(28.81,46.62) v1(29.45,46.62) v1(30.08,46.62) v1(30.72,46.62) v1(31.35,46.62) v1(31.99,46.62) v1(32.62,46.62) v1(33.26,46.62) v1(33.89,46.62) v1(34.53,46.62) v1(35.16,46.62) ; R13.1 18.01,37.35 17.38,37.35 17.25,37.48 17.25,40.78 17.14,40.89 C19.1 16.57,41.87 v1(16.62,41.92) ; v1(46.85,25.79) 46.85,25.4 C27.2 ; v1(14.59,23.38) 13.83,23.38 13.59,23.14 R25.2
  Top Layer w0.508: v1(24.48,58.07) C15.1 28.21,58.07 C14.1 30.14,58.02 C13.1 v1(32.06,58.04)
  Top Layer w0.762: C8.1 53.81,33.78 50.42,33.78 50.16,34.04 C29.2 ; v1(60.31,26.81) 60.31,22.59 59.54,21.82 R18.1 57.66,21.76 57.66,21.08 57.28,20.7 46.48,20.7 45.85,21.34 45.85,24.11 C27.2 ; C25.1 64.71,25.78 64.13,25.78 63.75,26.16 U8.6 ; C11.1 59.97,33.81 60.33,34.16 60.33,38.33 U9.1
  Inner1 w0.254: v1(28.18,46.62) 25.38,46.62 25.15,46.39 v1(25.15,45.95) ; v1(41.26,20.46) 45.7,20.46 45.9,20.65 v1(45.9,26.59) ; v1(60.31,26.81) 67.17,26.81 67.67,26.3 67.67,24.11 v1(67.69,24.09) ; v1(23.61,48.27) 24.79,48.27 24.83,48.23 v1(24.83,50.29) 24.87,50.34 24.87,50.81 24.48,51.2 v1(24.48,58.07) ; v1(22.97,27.01) 14.91,27.01 14.59,26.68 v1(14.59,23.38) 4.43,23.38 3.92,22.87 3.92,13.6 3.54,13.22 1.68,13.22 +5V#2.5 ; v1(35.92,33.41) 36.05,33.54 37.83,33.54 38.04,33.33 v1(38.04,27.84)
  Bottom Layer w0.254: U17.18 39.35,26.63 39.35,28.33 39.23,28.46 38.72,28.46 ; C1.2 23.43,44.13 23.22,44.34 v1(22.46,44.34) ; v1(35.16,46.62) 35.67,46.62 35.92,46.37 v1(35.92,33.41) 35.92,32.36 C31.2 ; v1(16.75,45.86) 16.75,42.05 v1(16.62,41.92) ; v1(23.6,48.27) 23.6,47.26 23.73,47.13 24.87,47.13 25.13,46.88 25.13,45.97 v1(25.15,45.95) ; v1(45.9,26.59) 46.05,26.59 v1(46.85,25.79)
  Bottom Layer w0.508: U17.4 U17.3 ; U17.10 U17.9
  vias: v1(5.19,50.43) v1(36.71,56.43)
VCC: length 15.6
  Top Layer w0.762: VCC GND.2 70.06,8.59 68.45,6.99 58.55,6.99 58.17,7.37 58.17,8.94 +12 VCC.2
VDDA: length 18.6
  Top Layer w0.254: U1.42 37.87,60.8 37.43,61.24 U4.2
  Top Layer w0.508: U4.2 C18.2 30.33,62 29.95,62.37 28.18,62.37 C17.1
VSSA: length 20.5
  Top Layer w0.254: C18.1 30.33,60.33 30.56,60.57 37.17,60.57 v1(37.19,60.59) ; v1(38.46,56.53) 38.37,56.44 U1.41
  Top Layer w0.508: C18.1 30.19,59.98 C17.2 28.03,59.84 U5.2
  Bottom Layer w0.254: v1(37.19,60.59) 38.21,60.59 38.46,60.34 v1(38.46,56.53)
AIN1: length 15.4
  Top Layer w0.254: U1.4 v1(39.73,35.17)
  Inner1 w0.254: v1(41.13,25.03) 40.11,25.03 39.73,25.41 v1(39.73,35.17)
  Bottom Layer w0.254: U17.21 41.34,25.24 v1(41.13,25.03)
AIN2: length 16.4
  Top Layer w0.254: v1(44.05,35.7) 44.02,35.67 U1.5
  Inner1 w0.254: v1(41.99,24.9) 41.99,35.57 42.12,35.7 v1(44.05,35.7)
  Bottom Layer w0.254: U17.22 v1(41.99,24.9)
AO1: length 57.7
  Inner2 w0.508: v1(42.91,18.55) 42.91,16.27 43.8,15.38 43.8,4.33 44.31,3.82 83.29,3.82 84.09,3.03 +5V.1
  Bottom Layer w0.254: U17.2 U17.1
AO2: length 53.7
  Inner2 w0.508: +5V.6 85.71,15.75 85.71,20.84 85.33,21.22 40.75,21.22 40.37,20.85 v1(40.37,18.55)
  Bottom Layer w0.254: U17.6 U17.5
BIN1: length 17.2
  Top Layer w0.254: U1.132 34.37,33.39 v1(34.65,33.67)
  Inner1 w0.254: v1(34.65,33.67) 34.65,24.65 34.91,24.4 38.34,24.4 v1(38.84,24.9)
  Bottom Layer w0.254: U17.17 38.74,25.01 v1(38.84,24.9)
BIN2: length 11.2
  Top Layer w0.254: U1.133 34.87,25.45 35.16,25.16 v1(38.08,25.16)
  Bottom Layer w0.254: U17.16 38.08,26.57 v1(38.08,25.16)
BO1: length 49.4
  Inner2 w0.508: v1(36.49,18.57) 35.29,17.38 35.29,7.12 34.78,6.62 4.43,6.62 3.79,5.98 3.79,3.44 3.38,3.03 +5V#2.1
  Bottom Layer w0.254: U17.12 U17.11
BO2: length 46
  Inner2 w0.508: +5V#2.6 1.63,15.75 1.63,20.97 1.89,21.22 38.84,21.22 39.1,20.97 v1(39.1,18.55)
  Bottom Layer w0.254: U17.8 U17.7
BUZZER: length 36
  Top Layer w0.254: U1.9 v1(47.35,37.67)
  Inner1 w0.254: v1(70.91,29.74) 70.78,29.86 66.15,29.86 65.77,30.24 65.77,36.97 65.07,37.67 v1(47.35,37.67)
ESR0: length 9
  Top Layer w0.254: U1.98 19.97,38.67 v1(19.67,38.37)
  Inner2 w0.254: v1(19.67,38.37) 19.29,37.99 19.16,37.99 18.78,37.6 18.78,36.84 18.52,36.59 14.71,36.59 v1(14.59,36.46)
  Bottom Layer w0.254: v1(14.59,36.46) 14.87,36.74 R1.1
ESR1: length 7.8
  Top Layer w0.254: v1(19.03,39.76) 19.13,39.67 U1.96
  Bottom Layer w0.254: 19.03,39.51 19.03,38.49 18.91,38.37 14.99,38.37 14.87,38.49 14.87,38.93
IMU_CS: length 30.7
  Top Layer w0.254: 26.42,14.61 26.42,15.63 26.16,15.89 20.3,15.89 19.92,16.27 19.92,20.59 19.54,20.97 18.02,20.97 17.64,21.35 17.64,33.79 18.01,34.17 U1.107
IMU_SCL: length 33.9
  Top Layer w0.254: v1(34.02,19.06) 34.02,14.62 CS SDO SDA SCL GND 3V3.3 ; v1(22.59,35.45) 22.31,35.17 U1.105
  Inner1 w0.254: v1(34.02,19.06) 34.02,35.32 33.76,35.57 22.72,35.57 v1(22.59,35.45)
IMU_SDA: length 30.6
  Top Layer w0.254: U1.108 20.3,33.67 20.05,33.41 20.05,21.35 20.68,20.71 20.68,16.9 20.94,16.65 26.91,16.65 27.16,16.4 v1(27.16,16.14)
  Bottom Layer w0.254: v1(27.16,16.14) 31.37,16.14 31.5,16.01 CS SDO SDA SCL GND 3V3.4
IMU_SDO: length 27.3
  Top Layer w0.254: U1.106 v1(22.72,34.67)
  Inner1 w0.254: CS SDO SDA SCL GND 3V3.5 28.94,14.62 28.94,16.4 28.56,16.78 24.37,16.78 24.11,17.03 24.11,34.3 23.75,34.67 v1(22.72,34.67)
KEY1: length 56.2
  Top Layer w0.254: U1.74 21.06,50.69 19.92,50.69 v1(19.54,51.07) ; SW1.1 v1(8.62,8.35)
  Bottom Layer w0.254: v1(19.54,51.07) 11.03,51.07 10.78,50.81 10.78,8.65 10.48,8.35 v1(8.62,8.35)
KEY2: length 50.5
  Top Layer w0.254: U1.75 19.17,50.17 v1(19.03,50.3) ; SW2.1 v1(13.57,8.37)
  Bottom Layer w0.254: v1(13.57,8.37) 13.57,50.05 13.83,50.3 v1(19.03,50.3)
KEY3: length 51.6
  Top Layer w0.254: v1(16.37,8.39) 16.39,8.37 SW3.1 ; 18.4,49.67 U1.76
  Bottom Layer w0.254: v1(18.4,49.67) 14.21,49.67 13.95,49.42 13.95,8.81 14.37,8.39 v1(16.37,8.39)
L_ENCA: length 106.6
  Top Layer w0.254: +5V.3 83.2,8.11 82.79,8.52 v1(82.79,43.07) ; v1(27.16,54.88) 27.37,54.66 U1.63
  Bottom Layer w0.254: v1(82.79,43.07) 82.79,51.96 82.28,52.46 27.41,52.46 27.16,52.72 v1(27.16,54.88)
L_ENCB: length 105.9
  Top Layer w0.254: +5V.4 86.51,10.65 86.76,10.9 86.76,42.52 v1(86.34,42.94) ; U1.62 27.87,55.21 v1(28.05,55.38)
  Bottom Layer w0.254: v1(86.34,42.94) 86.34,52.34 85.96,52.72 83.29,52.72 82.91,53.1 82.91,54.88 82.41,55.38 v1(28.05,55.38)
LCD_BLK: length 40.5
  Top Layer w0.254: v1(26.65,34.3) 26.34,34.3 25.87,33.84 U1.115
  Inner1 w0.254: v1(26.78,40.91) 26.78,44.72 26.4,45.1 5.06,45.1 4.68,44.72 4.68,42.68 4.17,42.18 U32.8
  Bottom Layer w0.254: v1(26.78,40.91) 26.78,34.43 v1(26.65,34.3)
LCD_CS: length 43.1
  Top Layer w0.254: v1(22.59,33.79) 23.6,33.79 23.87,33.53 U1.111
  Inner2 w0.254: v1(22.59,33.79) 21.95,33.79 21.83,33.92 21.83,53.35 21.19,53.99 2.27,53.99
LCD_DC: length 38.9
  Top Layer w0.254: U1.109 22.76,31.98 22.18,31.98 v1(21.83,31.64)
  Inner2 w0.254: 2.27,48.91 2.4,49.03 20.05,49.03 20.3,48.78 20.3,31.51 20.81,31 21.57,31 21.83,31.25 v1(21.83,31.64)
LCD_MOSI: length 37.1
  Top Layer w0.254: U1.114 25.37,33.15 25.52,33.29 25.52,34.31 26.14,34.94 v1(26.14,36.21)
  Inner1 w0.254: v1(26.14,36.21) 26.14,39.51 25.26,40.4 24.11,40.4 23.73,40.78 23.73,43.45 23.48,43.7 20.18,43.7 v1(19.54,44.34)
  Inner2 w0.254: 2.27,46.37 15.73,46.37 16.11,45.99 16.11,44.59 16.37,44.34 v1(19.54,44.34)
LCD_RST: length 41.9
  Top Layer w0.254: U1.110 23.37,33.01 23.22,33.16 22.13,33.16 21.83,32.86 v1(21.83,32.52)
  Inner2 w0.254: 2.27,51.45 2.78,51.96 20.94,51.96 21.32,51.57 21.32,33.03 v1(21.83,32.52)
LCD_SCK: length 58.3
  Top Layer w0.254: v1(25,34.81) 24.62,34.81 24.24,34.43 24.24,33.03 24.37,32.9 U1.112
  Inner2 w0.254: v1(3.92,55.13) 25.13,55.13 25.89,54.37 25.89,37.99 25,37.1 v1(25,34.81)
  Bottom Layer w0.254: v1(3.92,55.13) 3.92,45.48 3.54,45.1 2.65,45.1 U32.7 2.27,43.83
P0.7: length 46.5
  Top Layer w0.254: v1(47.86,42.18) 47.85,42.17 U1.18
  Bottom Layer w0.254: v1(47.86,42.18) 48.37,42.18 48.73,41.82 48.73,3.34 PWM 5V GND.1
P0.8: length 57.3
  Top Layer w0.254: v1(47.35,42.94) 47.08,42.67 U1.19
  Bottom Layer w0.254: PWM 5V GND#2.1 59.54,39.89 59.04,40.4 51.29,40.4 50.91,40.78 50.91,42.56 50.53,42.94 v1(47.35,42.94)
P0.9: length 27
  Top Layer w0.254: v1(46.08,45.48) 46.08,52.08 46.85,52.84 3V3 RX TX GND#3.3 ; v1(45.45,43.45) 45.17,43.17 U1.20
  Bottom Layer w0.254: v1(45.45,43.45) 46.08,44.08 v1(46.08,45.48)
P0.12: length 24.7
  Top Layer w0.254: v1(44.18,43.83) 44.02,43.67 U1.21 ; 3V3 RX TX GND#3.2 v1(44.31,45.73)
  Bottom Layer w0.254: v1(44.18,43.83) 44.31,43.95 v1(44.31,45.73)
P2.5: length 17.4
  Top Layer w0.254: U1.6 43.2,36.17 43.49,36.46 44.56,36.46 v1(44.81,36.21)
  Inner1 w0.254: v1(43,24.9) 43,34.4 43.29,34.68 44.43,34.68 44.81,35.06 v1(44.81,36.21)
  Bottom Layer w0.254: U17.23 42.64,25.17 42.91,24.9
P2.7: length 15
  Top Layer w0.254: U1.8 40.69,37.17 v1(40.62,37.1)
  Bottom Layer w0.254: U17.15 37.44,29.22 37.7,29.48 40.37,29.48 40.62,29.73 v1(40.62,37.1)
P10.1: length 57.8
  Top Layer w0.254: U1.140 38.37,29.77 38.08,29.48 v1(36.05,29.48) ; +5V#2.4 1.75,10.55 3.67,10.55 3.92,10.81 v1(3.92,29.48)
  Inner2 w0.254: v1(36.05,29.48) v1(3.92,29.48)
P10.3: length 64
  Top Layer w0.254: v1(6.08,28.84) 6.08,8.65 5.54,8.11 +5V#2.3 ; v1(41.13,29.22) 41.13,30.11 40.75,30.49 39.73,30.49 39.37,30.85 U1.142
  Inner2 w0.254: v1(41.13,29.22) 40.75,28.84 v1(6.08,28.84)
P13.1: length 33.1
  Top Layer w0.254: U30.3 R26.1 49.13,16.77 48.37,17.54 45.07,17.54 44.56,18.05 44.56,21.98 44.05,22.49 v1(40.62,22.49) ; v1(38.34,22.49) 34.53,22.49 34.27,22.75 34.27,29.98 33.89,30.37 33.13,30.37 32.87,30.62 U1.129
  Bottom Layer w0.254: v1(38.34,22.49) v1(40.62,22.49)
P13.2: length 34.4
  Top Layer w0.254: v1(33.38,33.79) 33.38,31.88 U1.130 ; U30.4 R27.1 43.93,16.77 43.67,17.03 43.67,21.6 43.42,21.86 40.11,21.86 39.61,22.36 39.61,29.73 v1(39.1,30.24)
  Inner2 w0.254: v1(39.1,30.24) 33.64,30.24 33.38,30.49 v1(33.38,33.79)
P14.0: length 94.5
  Top Layer w0.254: v1(28.18,34.05) 27.67,34.05 27.37,33.75 U1.118
  Inner1 w0.254: v1(29.32,17.67) v1(41,17.67) ; TX RX GND 3V3.4 20.07,9.05 20.43,9.41 26.14,9.41 26.4,9.16 26.4,7.89
  Inner2 w0.254: v1(39.46,7.12) 39.99,7.12 40.24,6.87 40.24,6.49 40.37,6.36 40.88,6.36 41,6.24 41,2.68 TMS TCK TDP TRST PORST.4
  Bottom Layer w0.254: v1(29.32,17.67) 29.32,33.79 29.07,34.05 v1(28.18,34.05) ; 41,2.69 40.99,2.68 30.72,2.68 30.46,2.93 30.46,3.82 30.21,4.08 20.43,4.08 20.07,3.71 TX RX GND 3V3.4 ; 41,2.69 v1(41,17.67) ; 41,2.69 41,1.66 40.75,1.41 TMS TCK TDP TRST PORST.4
P14.1: length 83.5
  Top Layer w0.254: v1(28.56,18.3) 28.56,16.27 28.81,16.01 30.08,16.01 30.34,15.76 30.34,13.47 30.59,13.22 v1(42.15,13.22) ; TMS TCK TDP TRST PORST.5 43.29,1.41 43.67,1.79 43.67,6.87 43.42,7.12 LED3.1 ; 28.05,33.16 27.87,32.98 U1.119
  Inner1 w0.254: 23.9,4.08 30.21,4.08 30.46,3.82 30.46,2.93 30.72,2.68 42.02,2.68 42.27,2.43 TMS TCK TDP TRST PORST.5 ; 23.9,4.08 22.97,4.08 22.61,3.71 TX RX GND 3V3.3 ; 23.9,4.08 23.86,4.11 23.86,7.89
  Bottom Layer w0.254: TMS TCK TDP TRST PORST.5 43.29,1.41 43.54,1.66 43.54,12.97 43.29,13.22 v1(42.15,13.22) ; v1(28.18,33.29) 28.56,32.91 v1(28.56,18.3)
P14.2: length 8.5
  Top Layer w0.254: 22.97,28.51 22.97,30.37 23.22,30.62 28.18,30.62 28.37,30.82 U1.120
P14.3: length 7.2
  Top Layer w0.254: U1.121 28.87,30.55 28.56,30.24 24.87,30.24 24.69,30.05 24.69,28.51
P14.4: length 8.8
  Top Layer w0.254: R16.1 31.61,29.24 v1(31.61,30.24) ; U1.122 29.37,33.47 v1(29.95,34.05)
  Bottom Layer w0.254: v1(29.95,34.05) 31.48,34.05 31.61,33.92 v1(31.61,30.24)
P14.5: length 6.5
  Top Layer w0.254: 26.41,28.51 26.41,29.61 26.65,29.86 29.57,29.86 29.87,30.16 U1.123
P14.6: length 5.3
  Top Layer w0.254: 28.13,28.51 28.13,29.17 28.3,29.35 30.08,29.35 30.37,29.64 U1.124
P15.4: length 39.9
  Top Layer w0.254: U1.113 v1(24.87,33.67)
  Inner1 w0.254: v1(24.87,33.67) 26.65,33.67 27.16,33.16 27.16,17.41 27.41,17.16 28.81,17.16 29.19,16.78 30.59,16.78 31.22,16.14 44.69,16.14 45.09,15.74 U30.5
P20.2: length 11.1
  Top Layer w0.254: v1(19.54,40.4) 19.81,40.67 U1.94 ; v1(17.89,43.07) 15.14,43.07 14.59,42.51 v1(14.59,42.05)
  Bottom Layer w0.254: v1(19.54,40.4) 18.02,40.4 17.89,40.53 v1(17.89,43.07) ; 14.89,40.92 14.59,41.22 v1(14.59,42.05)
P20.6: length 26.9
  Top Layer w0.254: U1.100 22.1,37.67 22.33,37.43 22.33,36.59
  Inner1 w0.254: 2.27,36.21 2.27,37.22 2.65,37.6 16.87,37.6 17.13,37.86 17.13,38.75 17.51,39.13 20.94,39.13 21.19,38.87 21.19,37.1 21.83,36.46 v1(22.46,36.46)
P20.7: length 22.2
  Top Layer w0.254: U1.101 19.85,37.17 v1(19.67,37.35)
  Inner1 w0.254: U32.11 2.27,33.92 2.52,33.67 14.59,33.67 14.97,34.05 14.97,35.83 15.68,36.54 17.84,36.54 18.65,37.35 v1(19.67,37.35)
P20.8: length 63
  Top Layer w0.254: v1(19.41,36.59) 19.49,36.67 U1.102 ; v1(21.06,32.14) 21.06,22.11 21.83,21.35 41.26,21.35 41.89,20.71 41.89,15.51 42.55,14.85 U30.6
  Inner1 w0.254: 19.29,32.14 19.41,32.27 v1(19.41,36.59) ; 19.29,32.14 2.52,32.14 2.27,31.89 ; 19.29,32.14 v1(21.06,32.14)
P20.9: length 28.7
  Top Layer w0.254: v1(16.37,35.95) 19.83,35.95 20.05,36.17 U1.103
  Inner1 w0.254: v1(16.37,35.95) 16.37,33.41 16.11,33.16 1.51,33.16 0.62,32.27 0.62,28.84 0.87,28.59 2.27,28.59
P33.12: length 17
  Top Layer w0.254: 24.87,52.97 24.87,54.37 24.49,54.75 22.59,54.75 22.21,55.13 22.21,64.66 22.46,64.91 23.6,64.91 23.86,65.16 3V3 RX TX GND#2.3
P33.13: length 16.1
  Top Layer w0.254: 3V3 RX TX GND#2.2 21.32,54.75 21.7,54.37 24.11,54.37 24.37,54.11 24.37,52.97 U1.69
PORST: length 80.2
  Top Layer w0.254: C19.2 18.03,40.84 R12.1 18.08,39.17 U1.97 ; 19.41,4.08 19.41,20.08 19.03,20.46 15.73,20.46 15.35,20.84 15.35,42.05 15.86,42.56 17.38,42.56 17.84,42.09 17.84,40.89 ; 19.41,4.08 30.21,4.08 30.46,3.82 30.46,2.93 30.72,2.68 42.02,2.68 42.27,2.93 TMS TCK TDP TRST PORST.6 ; 19.41,4.08 16.84,4.08 16.49,3.73 16.49,2.32 RST.2
TCK: length 60.5
  Top Layer w0.254: 34.67,3.94 34.65,3.95 34.65,4.97 34.53,5.09 v1(20.81,5.09) ; v1(19.16,41.16) 19.54,41.16 20.05,41.67 U1.92
  Bottom Layer w0.254: v1(20.81,5.09) 20.05,5.85 20.05,33.03 20.18,33.16 23.1,33.16 23.4,33.46 R4.1 21.95,38.06 21.95,41.41 21.7,41.67 20.05,41.67 19.54,41.16 v1(19.16,41.16)
TDO: length 59.7
  Top Layer w0.254: v1(27.41,34.94) 27.41,38.87 27.16,39.13 v1(24.11,39.13) ; U1.90 18.89,42.67 v1(18.52,42.3)
  Inner1 w0.254: v1(32.11,17.03) v1(33.38,17.03)
  Bottom Layer w0.254: v1(18.52,42.3) 18.91,42.68 22.46,42.68 22.72,42.43 22.72,40.7 R6.1 23.86,40.02 24.11,39.77 v1(24.11,39.13) ; v1(33.38,17.03) 37.45,17.03 37.7,16.78 37.7,4.79 37.21,4.3 37.21,3.94 ; v1(27.41,34.94) 27.41,17.54 27.92,17.03 v1(32.11,17.03)
TMS: length 56.3
  Top Layer w0.254: v1(18.78,43.45) 19.06,43.17 U1.89
  Bottom Layer w0.254: 23.4,42.52 32.4,42.52 32.75,42.18 32.75,4.55 32.13,3.94 ; 23.4,42.52 R7.1 ; 23.4,42.52 23.4,42.76 23.22,42.94 22.86,42.94 22.36,43.45 v1(18.78,43.45)
TRST: length 59.2
  Top Layer w0.254: 39.75,3.94 39.73,3.95 39.73,5.6 39.48,5.85 v1(25.13,5.85) ; U1.91 19.66,42.17 v1(19.41,41.92)
  Bottom Layer w0.254: v1(25.13,5.85) 25.13,15.38 24.87,15.63 24.37,15.63 24.11,15.89 24.11,38.24 24.05,38.3 R5.1 22.33,39.37 22.33,41.92 22.08,42.18 19.67,42.18 v1(19.41,41.92)
$1N4159: length 2.6
  Top Layer w0.254: U2.2 37.14,55.05 37.37,54.82 U1.43
$1N5074: length 20.6
  Top Layer w0.254: v1(24.83,43.82) 24.84,43.83 26.4,43.83 26.53,43.95 v1(26.53,48.15) ; U1.82 19.37,46.67 v1(19.29,46.75)
  Bottom Layer w0.254: U3.1 v1(26.53,48.15) 26.53,49.03 26.4,49.16 18.91,49.16 18.78,49.03 18.78,46.88 18.91,46.75 v1(19.29,46.75)
$1N5220: length 20
  Top Layer w0.254: U1.81 19.76,47.17 v1(19.41,47.51)
  Bottom Layer w0.254: C2.2 23.43,49.72 23.6,49.54 26.91,49.54 27.16,49.29 27.16,45.22 26.91,44.97 23.61,44.97 23.45,45.12 U3.3 23.45,46.39 22.33,47.51 v1(19.41,47.51)
$1N7124: length 27.3
  Top Layer w0.254: v1(31.61,11.06) 37.7,11.06 37.86,10.9 LED2.2
  Inner2 w0.254: v1(31.61,11.06) 30.46,11.06 30.34,11.19 v1(30.34,20.21)
  Bottom Layer w0.254: v1(31.65,25.93) 30.73,25.93 30.34,25.54 v1(30.34,20.21)
$1N7149: length 37.1
  Top Layer w0.254: LED3.2 41.29,8.17 41.64,8.52 43.67,8.52 v1(44.56,9.41) ; v1(33.38,22.24) 33,22.62 30.46,22.62 30.21,22.87 30.21,27.44 30.32,27.56 R15.1
  Bottom Layer w0.254: v1(44.56,9.41) 44.18,9.79 44.18,13.35 43.8,13.73 43.8,20.84 43.29,21.35 34.27,21.35 v1(33.38,22.24)
$1N7661: length 14.3
  Top Layer w0.508: 66.87,50.11 64.9,50.11 C20.1 64.59,50.03 C21.2 C22.2 59.6,49.24 D1.2 D2.2 55.72,49.47 U6.3
$1N7734: length 21.7
  Top Layer w0.508: C20.2 62.6,52.31 62.48,52.2 62.48,51.49 62.43,51.43 60.39,51.43 60.39,52.51 60.17,52.74 54.39,52.74 54.06,52.41 U6.1 54.06,50.56 51.67,50.56 50.66,49.54 49.89,49.54 ; C23.2 49.23,49.91 C24.1
$1N8172: length 3.6
  Top Layer w0.762: U8.1 57.62,30.23 57.88,30.48 C26.2
$1N8173: length 19.2
  Top Layer w0.762: U7.2 55.23,30.85 55.88,31.5 60.83,31.5 61.03,31.3 C26.1 62.87,30.48 63.03,30.32 U8.8 67.48,28.7 D3.1
$1N8175: length 4.6
  Top Layer w0.762: U8.4 57.6,24.87 R18.2 57.52,23.24 56.13,23.24 55.87,22.98 R17.1
$1N8904: length 1.7
  Top Layer w0.254: LED4.1 61.31,14.48 R20.1
$1N8906: length 1.8
  Top Layer w0.254: R19.1 58.05,14.69 LED5.1
$1N14813: length 8.1
  Top Layer w0.762: v1(73.44,34.29) 73.06,34.67 U28.1
  Bottom Layer w0.762: Q1.3 v1(73.44,34.29)
$1N14815: length 5.1
  Bottom Layer w0.381: R24.1 70.91,27.39 71.25,27.05 73.91,27.05 74.4,27.53 Q1.1
$1N14820: length 5.4
  Bottom Layer w0.762: R23.1 76.09,33.91 76.86,34.67 76.95,34.67
$1N14998: length 17
  Top Layer w0.508: SW1.2 12.43,16.25 SW2.2 SW3.2 17.51,16.29 17.51,19.06 17.13,19.44 R25.1

## Copper pours and planes (outline as drawn; the poured copper is in the pictures)
+12V on Bottom Layer: 36.05,27.19 36.81,27.19 36.81,25.41 36.05,25.41
+12V on Bottom Layer: 43.16,27.19 44.94,27.19 44.94,26.05 43.16,26.05
GND on Top Layer: -6.24,74.82 101.33,74.82 101.33,-4.56 -6.24,-4.56
GND on Top Layer: 27.8,47 35.42,47 35.42,44.21 27.8,44.21
GND on Bottom Layer: -14.88,83.83 114.41,83.83 114.41,-12.05 -14.88,-12.05
GND on Inner1: -21.1,90.69 126.47,90.69 126.47,-18.78 -21.1,-18.78
GND on Inner2: -30.12,95.14 125.46,95.14 125.46,-31.86 -30.12,-31.86
AO1 on Bottom Layer: 42.53,20.08 43.29,20.08 43.29,18.55 42.53,18.55
AO2 on Bottom Layer: 39.87,20.01 40.88,20.01 40.88,18.55 39.87,18.55
BO2 on Bottom Layer: 38.72,20.08 39.48,20.08 39.48,18.55 38.72,18.55

Small or netless copper shapes (teardrops, artwork), in the pictures only: 388 on Top Layer, 158 on Bottom Layer, 73 on Inner1, 30 on Inner2
